# Altium project ECB02-Kit-V1.0.PrjPCB
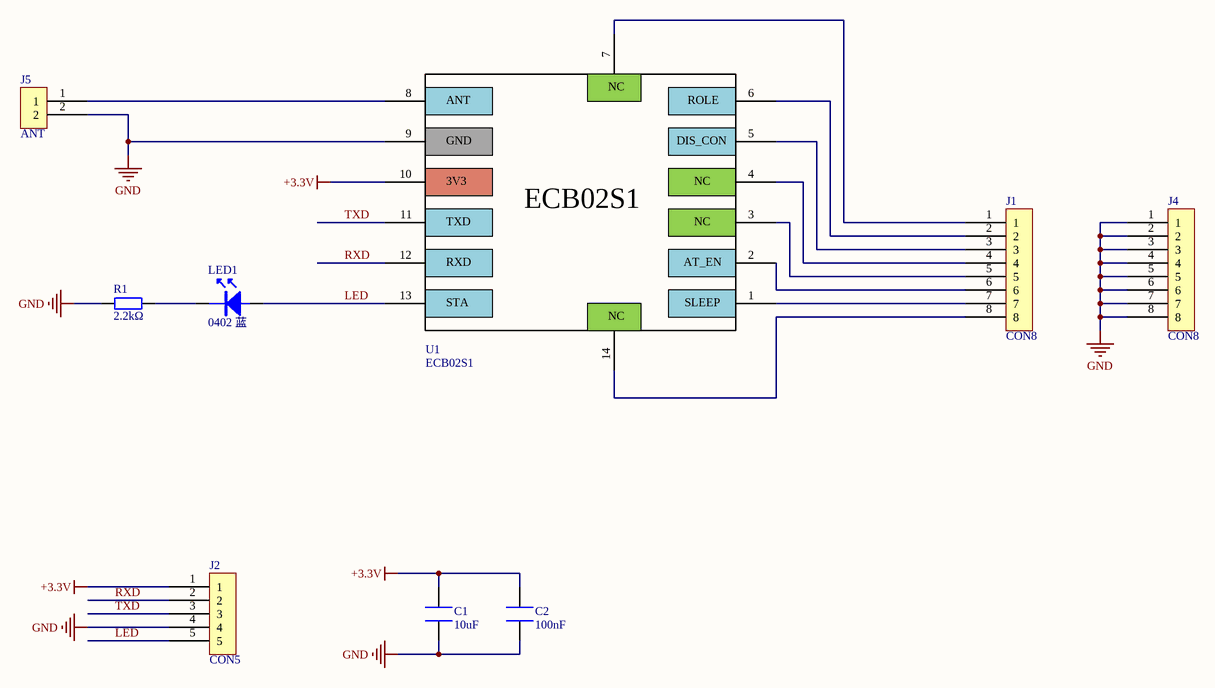
[diagram p0: ECB02-Kit-V1.0.SchDoc]
1 sheet, 9 parts. Net scope: global (net labels, ports and power ports of the same name join across sheets).
Board file: ECB02-Kit-V1.0.PcbDoc

## Sheet ECB02-Kit-V1.0.SchDoc
size A4

### Parts
C1  10uF  [0402]
C2  100nF  [0402]
J1  CON8  [SIP08]
J2  CON5  [SIP05]
J4  CON8  [SIP08]
J5  ANT  [ANT-2.4G-1]
LED1  0402 蓝  [0402-led]
R1  2.2kΩ  [0402]
U1  ECB02S1

### Nets
+3.3V: C1.2 C2.2 J2.1 U1.10
GND: C1.1 C2.1 J2.4 J4.1 J4.2 J4.3 J4.4 J4.5 J4.6 J4.7 J4.8 J5.2 R1.2 U1.9
LED: J2.5 LED1.1 U1.13(STA)
RXD: J2.2 U1.12
TXD: J2.3 U1.11
NetJ1_1: J1.1 U1.7
NetJ1_2: J1.2 U1.6
NetJ1_3: J1.3 U1.5
NetJ1_4: J1.4 U1.4
NetJ1_5: J1.5 U1.3
NetJ1_6: J1.6 U1.2
NetJ1_7: J1.7 U1.1
NetJ1_8: J1.8 U1.14
NetJ5_1: J5.1 U1.8
NetLED1_2: LED1.2 R1.1

### Notes on the sheet
- (in symbol ECB02S1) NC; ANT; ROLE; GND; DIS_CON; 3V3; TXD; RXD; AT_EN; SLEEP

### Library data of the parts
C1 C2 = C: 类型: 电容; 封装: 0402; 参数规格: *; 厂家: *; 厂家料号: *
LED1 = LED-0402: 封装: 0402; 类型: LED; 厂家: *; 厂家料号: *; 参数规格: *; 参考价格: *; 编号: *; 备注: *
R1 = R: 类型: 电阻; 厂家: *; 厂家料号: *; 封装: 0402; 参数规格: *; 参考价格: *; 编号: *; 备注: *